# Altium schematic sheet Arduino Shield Connection.SchDoc
size A3; Company Name: Renesas Electronics America; CompanyURL: www.renesas.com; PageSetup: Record=PageOptions|CenterHorizontal=True|CenterVertical=True|PrintScale=1.00|XCorrection=1.00|YCorrection=1.00|PrintKind=1|BorderSize=5000000|LeftOffset=0|BottomOffset=0|Orientation=2|PaperLength=1000|PaperWidth=1000|Scale=100|PaperSource=7|PrintQuality=-4|MediaType=1|DitherType=10|PaperKind=A5 148x210mm|PrintScaleMode=1; ReleaseDate: 16.09.2025; Version: MP; SheetNumber: 5; SheetTotal: 18; VariantNumber: 0; DSheetNumber: 1
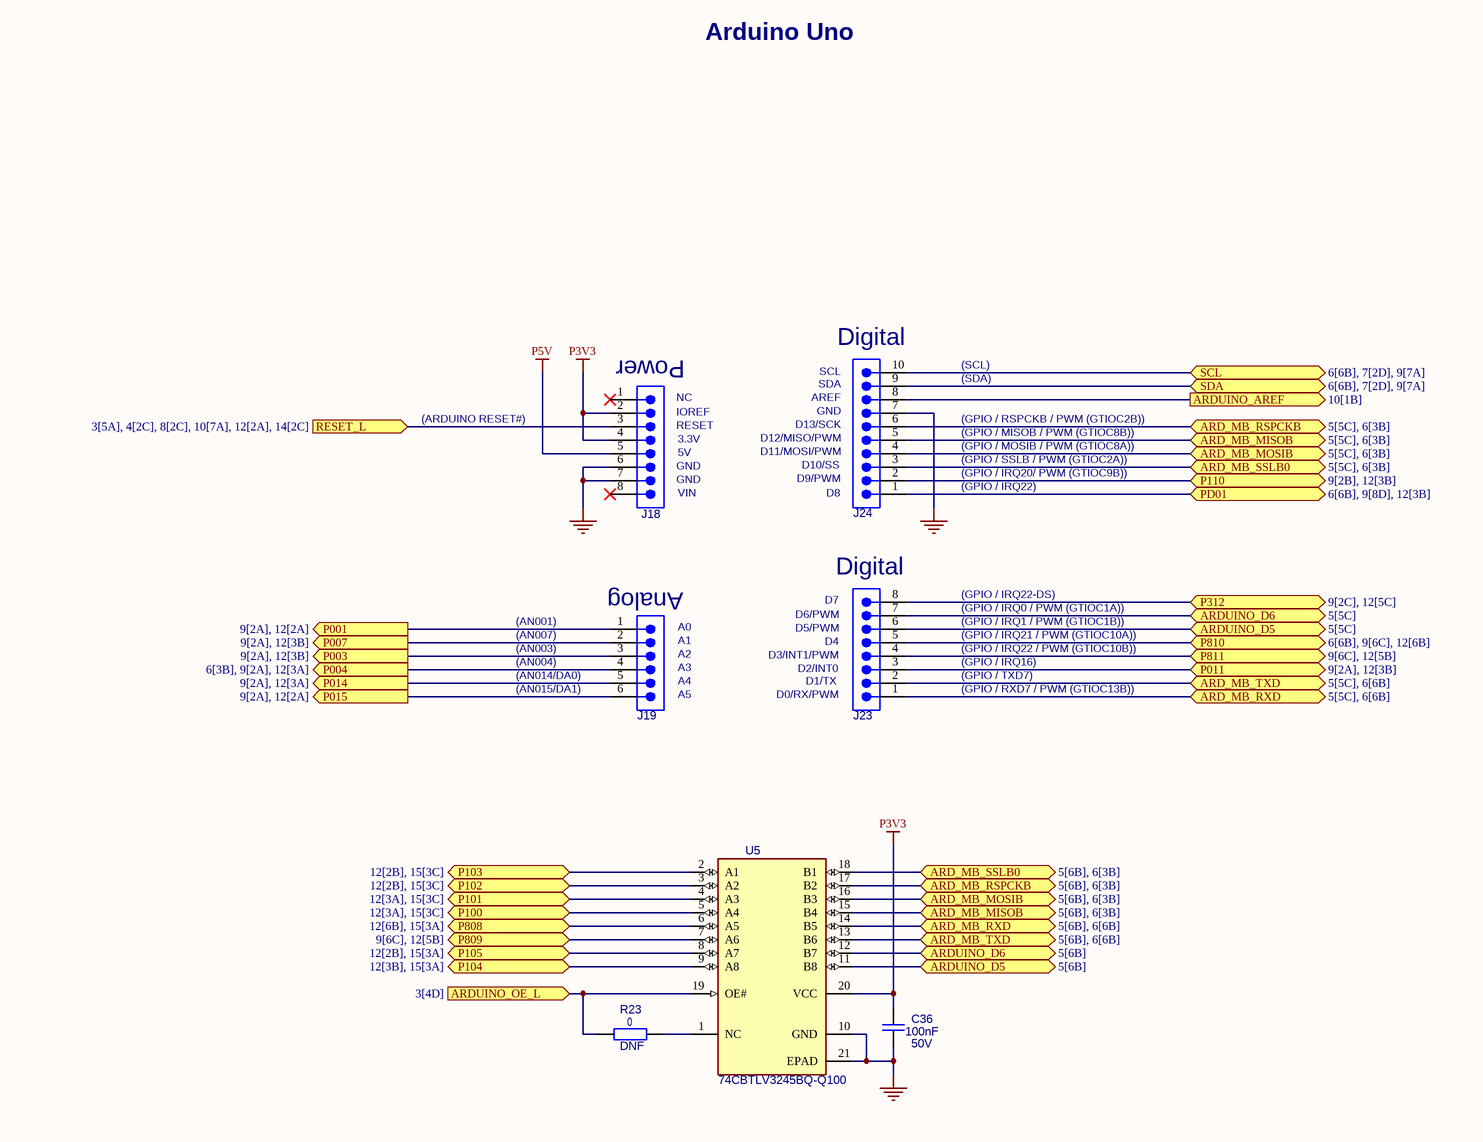
[diagram p0: Arduino Shield Connection.SchDoc]

## Parts
C36  value 100nF  Operating Voltage Max: 50V  [C_EIA0402_0p55]  (hidden comment: Capacitor)
J18  NPTC081KFXC-RC  [sul_NPTC081KFXC-RC]  (value not drawn)
J19  NPTC061KFXC-RC  [sul_NPTC061KFXC-RC]  (value not drawn)
J23  NPTC081KFXC-RC  [sul_NPTC081KFXC-RC]  (value not drawn)
J24  NPTC101KFXC-RC  [sul_NPTC101KFXC-RC]  (value not drawn)
R23  value 0  [R_EIA0402]  (hidden comment: Resistor)
U5  74CBTLV3245BQ-Q100  [nex_SOT-764-1_DHVQFN20]

## Ports
ARD_MB_MISOB (bidir, see 5[5C], 6[3B]), ARD_MB_MISOB (bidir, see 5[6B], 6[3B]), ARD_MB_MOSIB (bidir, see 5[5C], 6[3B]), ARD_MB_MOSIB (bidir, see 5[6B], 6[3B]), ARD_MB_RSPCKB (bidir, see 5[5C], 6[3B]), ARD_MB_RSPCKB (bidir, see 5[6B], 6[3B]), ARD_MB_RXD (bidir, see 5[5C], 6[6B]), ARD_MB_RXD (bidir, see 5[6B], 6[6B]), ARD_MB_SSLB0 (bidir, see 5[5C], 6[3B]), ARD_MB_SSLB0 (bidir, see 5[6B], 6[3B]), ARD_MB_TXD (bidir, see 5[5C], 6[6B]), ARD_MB_TXD (bidir, see 5[6B], 6[6B]), ARDUINO_AREF (out, see 10[1B]), ARDUINO_D5 (bidir, see 5[5C]), ARDUINO_D5 (bidir, see 5[6B]), ARDUINO_D6 (bidir, see 5[5C]), ARDUINO_D6 (bidir, see 5[6B]), ARDUINO_OE_L (in, see 3[4D]), P001 (out, see 9[2A], 12[2A]), P003 (out, see 9[2A], 12[3B]), P004 (out, see 6[3B], 9[2A], 12[3A]), P007 (out, see 9[2A], 12[3B]), P011 (bidir, see 9[2A], 12[3B]), P014 (out, see 9[2A], 12[3A]), P015 (out, see 9[2A], 12[2A]), P100 (bidir, see 12[3A], 15[3C]), P101 (bidir, see 12[3A], 15[3C]), P102 (bidir, see 12[2B], 15[3C]), P103 (bidir, see 12[2B], 15[3C]), P104 (bidir, see 12[3B], 15[3A]), P105 (bidir, see 12[2B], 15[3A]), P110 (bidir, see 9[2B], 12[3B]), P312 (bidir, see 9[2C], 12[5C]), P808 (bidir, see 12[6B], 15[3A]), P809 (bidir, see 9[6C], 12[5B]), P810 (bidir, see 6[6B], 9[6C], 12[6B]), P811 (bidir, see 9[6C], 12[5B]), PD01 (bidir, see 6[6B], 9[8D], 12[3B]), RESET_L (in, see 3[5A], 4[2C], 8[2C], 10[7A], 12[2A], 14[2C]), SCL (bidir, see 6[6B], 7[2D], 9[7A]), SDA (bidir, see 6[6B], 7[2D], 9[7A])

## Nets
GND: C36.1 J18.6 J18.7 J24.7 U5.10(GND) U5.21(EPAD)
P3V3: C36.2 J18.2 J18.4 U5.20(VCC)
P5V: J18.5
ARD_MB_MISOB: J24.5 U5.15(B4) ; port ARD_MB_MISOB
ARD_MB_MOSIB: J24.4 U5.16(B3) ; port ARD_MB_MOSIB
ARD_MB_RSPCKB: J24.6 U5.17(B2) ; port ARD_MB_RSPCKB
ARD_MB_RXD: J23.1 U5.14(B5) ; port ARD_MB_RXD
ARD_MB_SSLB0: J24.3 U5.18(B1) ; port ARD_MB_SSLB0
ARD_MB_TXD: J23.2 U5.13(B6) ; port ARD_MB_TXD
ARDUINO_AREF: J24.8 ; port ARDUINO_AREF
ARDUINO_D5: J23.6 U5.11(B8) ; port ARDUINO_D5
ARDUINO_D6: J23.7 U5.12(B7) ; port ARDUINO_D6
ARDUINO_OE_L: R23.1 U5.19(OE#) ; port ARDUINO_OE_L
P001: J19.1 ; port P001
P003: J19.3 ; port P003
P004: J19.4 ; port P004
P007: J19.2 ; port P007
P011: J23.3 ; port P011
P014: J19.5 ; port P014
P015: J19.6 ; port P015
P100: U5.5(A4) ; port P100
P101: U5.4(A3) ; port P101
P102: U5.3(A2) ; port P102
P103: U5.2(A1) ; port P103
P104: U5.9(A8) ; port P104
P105: U5.8(A7) ; port P105
P110: J24.2 ; port P110
P312: J23.8 ; port P312
P808: U5.6(A5) ; port P808
P809: U5.7(A6) ; port P809
P810: J23.5 ; port P810
P811: J23.4 ; port P811
PD01: J24.1 ; port PD01
RESET_L: J18.3 ; port RESET_L
SCL: J24.10 ; port SCL
SDA: J24.9 ; port SDA
NetR23_2: R23.2 U5.1(NC)

Not connected (* = marked no-connect by the designer): J18 1* 8*

## Notes on the sheet
- Arduino Uno
- (near J18) Power
- (near J24) Digital
- (ARDUINO RESET#)
- (near J18) NC
- (near J18) IOREF
- (near J18) RESET
- (near J24) D13/SCK
- (near J24) AREF
- (near J24) GND
- (near J24) SDA
- (near J24) SCL
- (SCL)
- (SDA)
- (GPIO / RSPCKB / PWM (GTIOC2B))
- (near J18) GND
- (near J18) 3.3V
- (near J18) 5V
- D12/MISO/PWM
- D11/MOSI/PWM
- (near J24) D9/PWM
- (near J24) D10/SS
- (GPIO / MISOB / PWM (GTIOC8B))
- (GPIO / MOSIB / PWM (GTIOC8A))
- (GPIO / SSLB / PWM (GTIOC2A))
- (GPIO / IRQ20/ PWM (GTIOC9B))
- (GPIO / IRQ22)
- (near J18) VIN
- (near J24) D8
- (AN001)
- (near J19) A0
- (near J19) Analog
- (near J23) D6/PWM
- (near J23) D7
- (near J23) Digital
- (GPIO / IRQ0 / PWM (GTIOC1A))
- (GPIO / IRQ1 / PWM (GTIOC1B))
- (GPIO / IRQ22-DS)
- (AN007)
- (AN015/DA1)
- (AN014/DA0)
- (AN004)
- (AN003)
- (near J19) A1
- (near J19) A5
- (near J19) A4
- (near J19) A3
- (near J19) A2
- (near J23) D3/INT1/PWM
- D0/RX/PWM
- (near J23) D5/PWM
- (near J23) D2/INT0
- (near J23) D1/TX
- (near J23) D4
- (GPIO / RXD7 / PWM (GTIOC13B))
- (GPIO / TXD7)
- (GPIO / IRQ21 / PWM (GTIOC10A))
- (GPIO / IRQ22 / PWM (GTIOC10B))
- (GPIO / IRQ16)
- www.renesas.com <http://www.renesas.com>
- Sheet:
- Title:
- Document Number:
- Version:
- Variant:
- Renesas Electronics
- Size:
- Date:
- Time:
- Page:
- of
- Product Issue:

## Library data of the parts
C36 = CAP-00003203-9: Capacitor,EIA0402,100n,50V,X7R; Tolerance: 10%; Qualification: AEC-Q200; Subtype: MLCC; Dielectric: X7R; Height: 550µm; Operating Temperature Max: 125°C; Operating Temperature Min: -55°C
J18 J23 = CON-00000044-4: Header, 8way, 1 Row, Vertical, 2.54mm, SMD; Current: 3A; Gender: female; Operating Voltage Max: 500V; Height: 7.75mm; Operating Temperature Min: -40°C; Qualification: -; Pin Count: 8; Operating Temperature Max: 125°C
J19 = CON-00000043-4: Header, 6way, 1 Row, Vertical, 2.54mm, SMD; Current: 3A; Operating Voltage Max: 500V; Gender: female; Operating Temperature Max: 125°C; Qualification: -; Height: 7.75mm; Operating Temperature Min: -40°C; Pin Count: 6
J24 = CON-00000045-4: Header, 10way, 1 Row, Vertical, 2.54mm, SMD; Operating Voltage Max: 500V; Current: 3A; Gender: female; Qualification: -; Operating Temperature Max: 125°C; Height: 7.75mm; Pin Count: 10; Operating Temperature Min: -40°C
R23 = RES-00000801-9: Resistor,EIA0402,0,0.0625W; Power: 62.5mW; Tolerance: 5%; Subtype: Chip Resistor; Operating Temperature Max: 155°C; Operating Temperature Min: -55°C; Qualification: -; DNF: DNF
U5 = ICS-00000017-5: Octal FET Bus Switch, 5 ohm, 0.3ns max delay, DHVQFN20; Current: 128mA; Operating Voltage Max: 3.6V; Operating Voltage Min: 2.3V; Output Voltage Min: 0V; Qualification: AEC-Q100; Operating Temperature Max: 125°C; Operating Temperature Min: -40°C; Output Voltage Max: 3.6V; Pin Count: 21; Subtype: Bus Switch